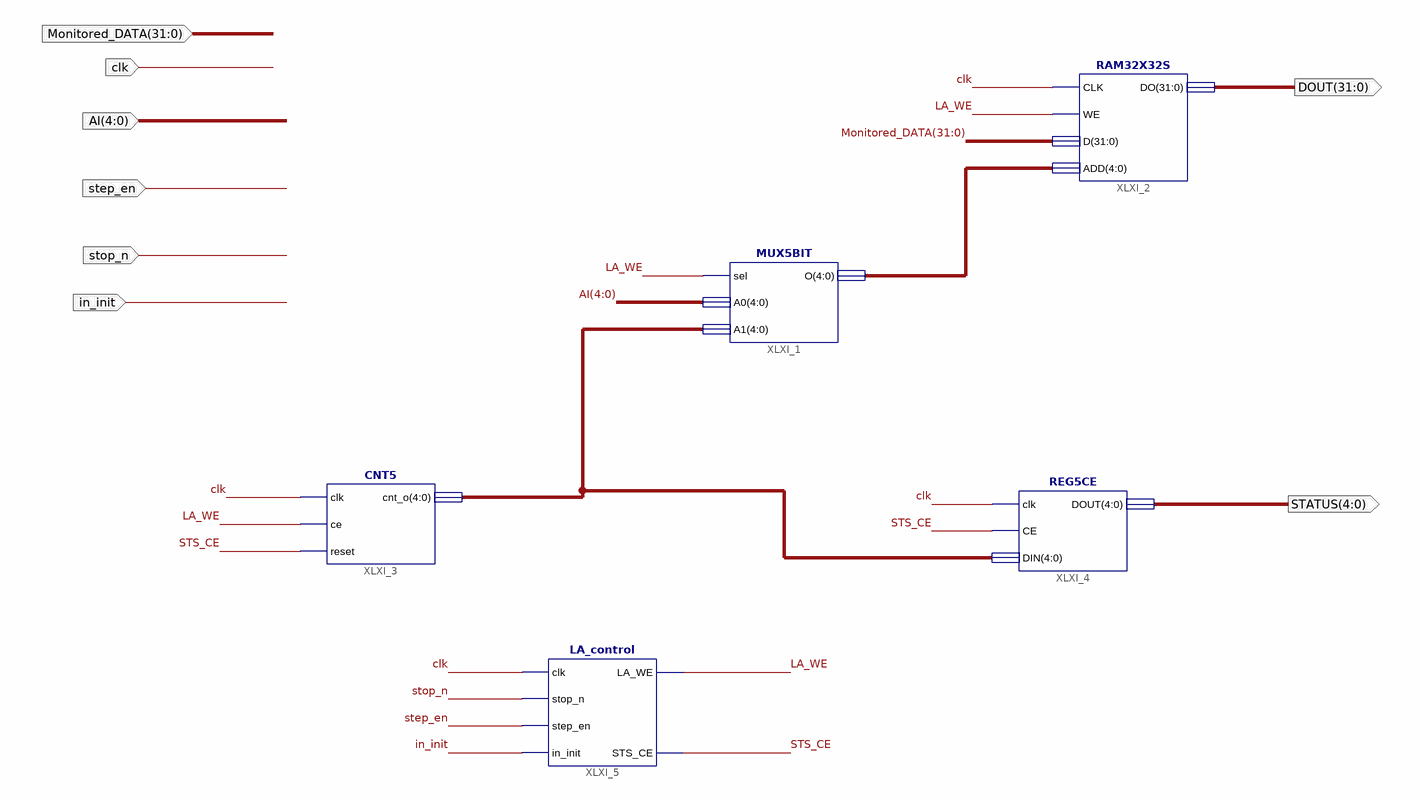
[diagram p0: schematic sheet 1]
// Xilinx ISE schematic Logic_anaylzer.sch (spartan6) as structural Verilog: 5 symbols, 8 ports
module Logic_anaylzer (
  input  clk,
  input  [4:0] AI,
  input  step_en,
  input  stop_n,
  input  in_init,
  input  [31:0] Monitored_DATA,
  output [4:0] STATUS,
  output [31:0] DOUT
);

  wire LA_WE, STS_CE;
  wire [4:0] XLXN_5, XLXN_8;

  MUX5BIT XLXI_1 (.sel(LA_WE), .A0(AI), .A1(XLXN_8), .O(XLXN_5));
  RAM32X32S XLXI_2 (.CLK(clk), .WE(LA_WE), .D(Monitored_DATA), .ADD(XLXN_5), .DO(DOUT));
  CNT5 XLXI_3 (.clk(clk), .ce(LA_WE), .reset(STS_CE), .cnt_o(XLXN_8));
  REG5CE XLXI_4 (.clk(clk), .CE(STS_CE), .DIN(XLXN_8), .DOUT(STATUS));
  LA_control XLXI_5 (.clk(clk), .stop_n(stop_n), .step_en(step_en), .in_init(in_init), .LA_WE(LA_WE), .STS_CE(STS_CE));
endmodule
